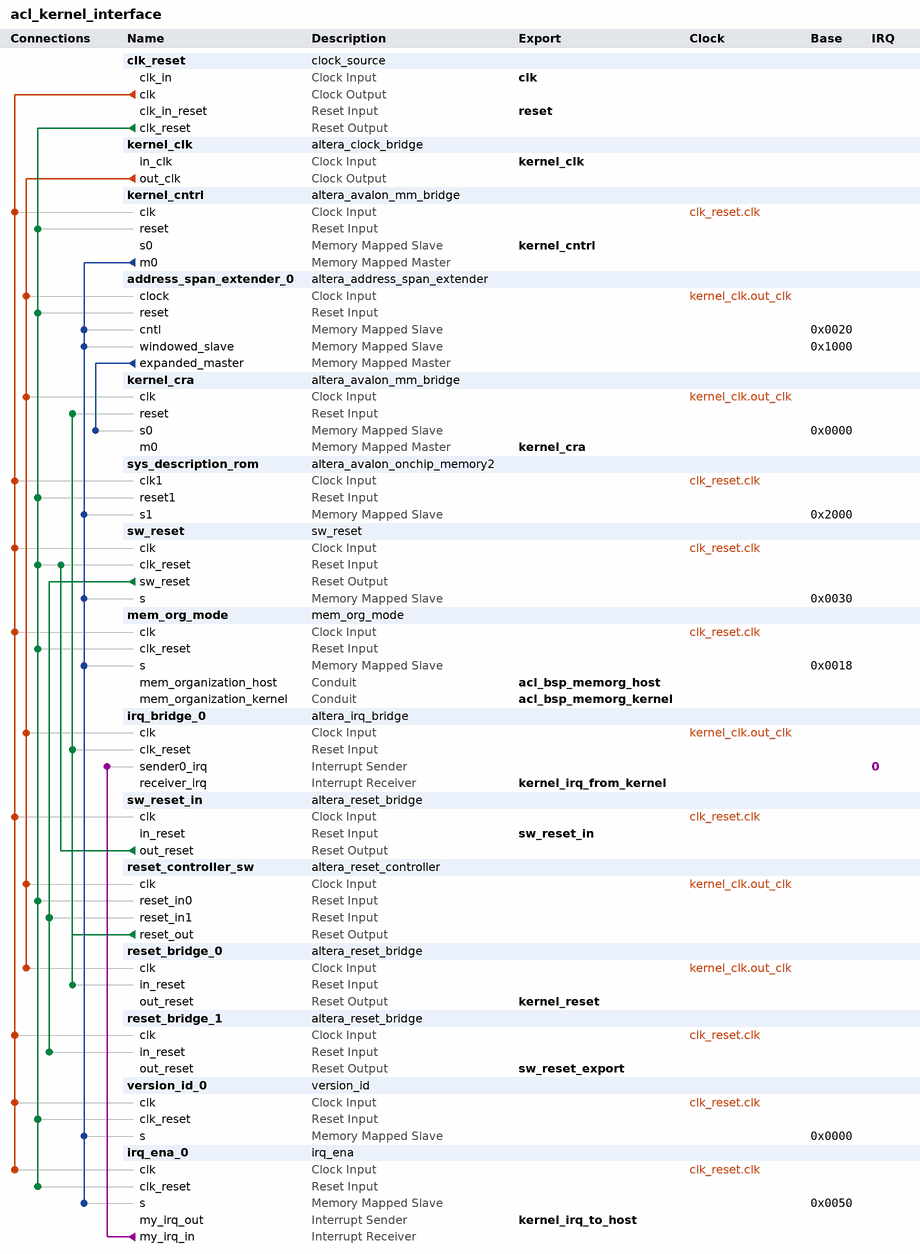
[diagram p0: system contents]
# Platform Designer (Qsys) system acl_kernel_interface, Cyclone V 5CSXFC6D6F31C8ES
# Parameters at their usual value, and those the tool derives, are not listed.
package require -exact qsys 14.1
create_system acl_kernel_interface
set_project_property DEVICE_FAMILY {Cyclone V}
set_project_property DEVICE 5CSXFC6D6F31C8ES

add_instance clk_reset clock_source 14.1
set_instance_parameter_value clk_reset clockFrequency 100000000
set_instance_parameter_value clk_reset resetSynchronousEdges DEASSERT

add_instance kernel_clk altera_clock_bridge 14.1
set_instance_parameter_value kernel_clk DERIVED_CLOCK_RATE 0
set_instance_parameter_value kernel_clk EXPLICIT_CLOCK_RATE 0

add_instance kernel_cntrl altera_avalon_mm_bridge 14.1
set_instance_parameter_value kernel_cntrl ADDRESS_UNITS SYMBOLS
set_instance_parameter_value kernel_cntrl ADDRESS_WIDTH 14
set_instance_parameter_value kernel_cntrl DATA_WIDTH 32
set_instance_parameter_value kernel_cntrl MAX_PENDING_RESPONSES 1
set_instance_parameter_value kernel_cntrl USE_AUTO_ADDRESS_WIDTH 0

add_instance address_span_extender_0 altera_address_span_extender 14.1
set_instance_parameter_value address_span_extender_0 BURSTCOUNT_WIDTH 1
set_instance_parameter_value address_span_extender_0 DATA_WIDTH 32
set_instance_parameter_value address_span_extender_0 MASTER_ADDRESS_DEF 0
set_instance_parameter_value address_span_extender_0 MASTER_ADDRESS_WIDTH 30
set_instance_parameter_value address_span_extender_0 MAX_PENDING_READS 1
set_instance_parameter_value address_span_extender_0 SLAVE_ADDRESS_WIDTH 10
set_instance_parameter_value address_span_extender_0 TERMINATE_SLAVE_PORT false

add_instance kernel_cra altera_avalon_mm_bridge 14.1
set_instance_parameter_value kernel_cra ADDRESS_UNITS SYMBOLS
set_instance_parameter_value kernel_cra ADDRESS_WIDTH 30
set_instance_parameter_value kernel_cra DATA_WIDTH 64
set_instance_parameter_value kernel_cra MAX_PENDING_RESPONSES 1
set_instance_parameter_value kernel_cra USE_AUTO_ADDRESS_WIDTH 0

add_instance sys_description_rom altera_avalon_onchip_memory2 14.1
set_instance_parameter_value sys_description_rom dataWidth 64
set_instance_parameter_value sys_description_rom dualPort false
set_instance_parameter_value sys_description_rom initMemContent true
set_instance_parameter_value sys_description_rom initializationFileName sys_description
set_instance_parameter_value sys_description_rom memorySize 4096
set_instance_parameter_value sys_description_rom slave1Latency 2
set_instance_parameter_value sys_description_rom useNonDefaultInitFile true
set_instance_parameter_value sys_description_rom writable false

add_instance sw_reset sw_reset 10.0
set_instance_parameter_value sw_reset LOG2_RESET_CYCLES 10
set_instance_parameter_value sw_reset WIDTH 64

add_instance mem_org_mode mem_org_mode 10.0
set_instance_parameter_value mem_org_mode WIDTH 32

add_instance irq_bridge_0 altera_irq_bridge 14.1
set_instance_parameter_value irq_bridge_0 IRQ_WIDTH 1

add_instance sw_reset_in altera_reset_bridge 14.1
set_instance_parameter_value sw_reset_in ACTIVE_LOW_RESET 0
set_instance_parameter_value sw_reset_in SYNCHRONOUS_EDGES deassert

add_instance reset_controller_sw altera_reset_controller 14.1
set_instance_parameter_value reset_controller_sw NUM_RESET_INPUTS 2
set_instance_parameter_value reset_controller_sw SYNC_DEPTH 2

add_instance reset_bridge_0 altera_reset_bridge 14.1
set_instance_parameter_value reset_bridge_0 ACTIVE_LOW_RESET 1
set_instance_parameter_value reset_bridge_0 SYNCHRONOUS_EDGES deassert

add_instance reset_bridge_1 altera_reset_bridge 14.1
set_instance_parameter_value reset_bridge_1 ACTIVE_LOW_RESET 1
set_instance_parameter_value reset_bridge_1 SYNCHRONOUS_EDGES deassert

add_instance version_id_0 version_id 10.0
set_instance_parameter_value version_id_0 VERSION_ID -1598029823
set_instance_parameter_value version_id_0 WIDTH 32

add_instance irq_ena_0 irq_ena 13.0

# connections
add_connection clk_reset.clk irq_ena_0.clk clock
add_connection clk_reset.clk kernel_cntrl.clk clock
add_connection clk_reset.clk mem_org_mode.clk clock
add_connection clk_reset.clk reset_bridge_1.clk clock
add_connection clk_reset.clk sw_reset.clk clock
add_connection clk_reset.clk sw_reset_in.clk clock
add_connection clk_reset.clk sys_description_rom.clk1 clock
add_connection clk_reset.clk version_id_0.clk clock
add_connection kernel_clk.out_clk address_span_extender_0.clock clock
add_connection kernel_clk.out_clk irq_bridge_0.clk clock
add_connection kernel_clk.out_clk kernel_cra.clk clock
add_connection kernel_clk.out_clk reset_bridge_0.clk clock
add_connection kernel_clk.out_clk reset_controller_sw.clk clock
add_connection clk_reset.clk_reset address_span_extender_0.reset reset
add_connection clk_reset.clk_reset irq_ena_0.clk_reset reset
add_connection clk_reset.clk_reset kernel_cntrl.reset reset
add_connection clk_reset.clk_reset mem_org_mode.clk_reset reset
add_connection clk_reset.clk_reset reset_controller_sw.reset_in0 reset
add_connection clk_reset.clk_reset sw_reset.clk_reset reset
add_connection clk_reset.clk_reset sys_description_rom.reset1 reset
add_connection clk_reset.clk_reset version_id_0.clk_reset reset
add_connection reset_controller_sw.reset_out irq_bridge_0.clk_reset reset
add_connection reset_controller_sw.reset_out kernel_cra.reset reset
add_connection reset_controller_sw.reset_out reset_bridge_0.in_reset reset
add_connection sw_reset.sw_reset reset_bridge_1.in_reset reset
add_connection sw_reset.sw_reset reset_controller_sw.reset_in1 reset
add_connection sw_reset_in.out_reset sw_reset.clk_reset reset
add_connection address_span_extender_0.expanded_master kernel_cra.s0 avalon
set_connection_parameter_value address_span_extender_0.expanded_master/kernel_cra.s0 baseAddress 0x0000
add_connection kernel_cntrl.m0 address_span_extender_0.cntl avalon
set_connection_parameter_value kernel_cntrl.m0/address_span_extender_0.cntl baseAddress 0x0020
add_connection kernel_cntrl.m0 address_span_extender_0.windowed_slave avalon
set_connection_parameter_value kernel_cntrl.m0/address_span_extender_0.windowed_slave baseAddress 0x1000
add_connection kernel_cntrl.m0 irq_ena_0.s avalon
set_connection_parameter_value kernel_cntrl.m0/irq_ena_0.s baseAddress 0x0050
add_connection kernel_cntrl.m0 mem_org_mode.s avalon
set_connection_parameter_value kernel_cntrl.m0/mem_org_mode.s baseAddress 0x0018
add_connection kernel_cntrl.m0 sw_reset.s avalon
set_connection_parameter_value kernel_cntrl.m0/sw_reset.s baseAddress 0x0030
add_connection kernel_cntrl.m0 sys_description_rom.s1 avalon
set_connection_parameter_value kernel_cntrl.m0/sys_description_rom.s1 baseAddress 0x2000
add_connection kernel_cntrl.m0 version_id_0.s avalon
set_connection_parameter_value kernel_cntrl.m0/version_id_0.s baseAddress 0x0000
add_connection irq_ena_0.my_irq_in irq_bridge_0.sender0_irq interrupt
set_connection_parameter_value irq_ena_0.my_irq_in/irq_bridge_0.sender0_irq irqNumber 0

# exported interfaces
add_interface acl_bsp_memorg_host conduit end
set_interface_property acl_bsp_memorg_host EXPORT_OF mem_org_mode.mem_organization_host
add_interface acl_bsp_memorg_kernel conduit end
set_interface_property acl_bsp_memorg_kernel EXPORT_OF mem_org_mode.mem_organization_kernel
add_interface clk clock sink
set_interface_property clk EXPORT_OF clk_reset.clk_in
add_interface kernel_clk clock sink
set_interface_property kernel_clk EXPORT_OF kernel_clk.in_clk
add_interface kernel_cntrl avalon slave
set_interface_property kernel_cntrl EXPORT_OF kernel_cntrl.s0
add_interface kernel_cra avalon master
set_interface_property kernel_cra EXPORT_OF kernel_cra.m0
add_interface kernel_irq_from_kernel interrupt receiver
set_interface_property kernel_irq_from_kernel EXPORT_OF irq_bridge_0.receiver_irq
add_interface kernel_irq_to_host interrupt sender
set_interface_property kernel_irq_to_host EXPORT_OF irq_ena_0.my_irq_out
add_interface kernel_reset reset source
set_interface_property kernel_reset EXPORT_OF reset_bridge_0.out_reset
add_interface reset reset sink
set_interface_property reset EXPORT_OF clk_reset.clk_in_reset
add_interface sw_reset_export reset source
set_interface_property sw_reset_export EXPORT_OF reset_bridge_1.out_reset
add_interface sw_reset_in reset sink
set_interface_property sw_reset_in EXPORT_OF sw_reset_in.in_reset

set_interconnect_requirement {$system} qsys_mm.clockCrossingAdapter HANDSHAKE
set_interconnect_requirement {$system} qsys_mm.maxAdditionalLatency 0

save_system acl_kernel_interface.qsys
